# EAGLE schematic blitzbox (EAGLE 7.2.0)
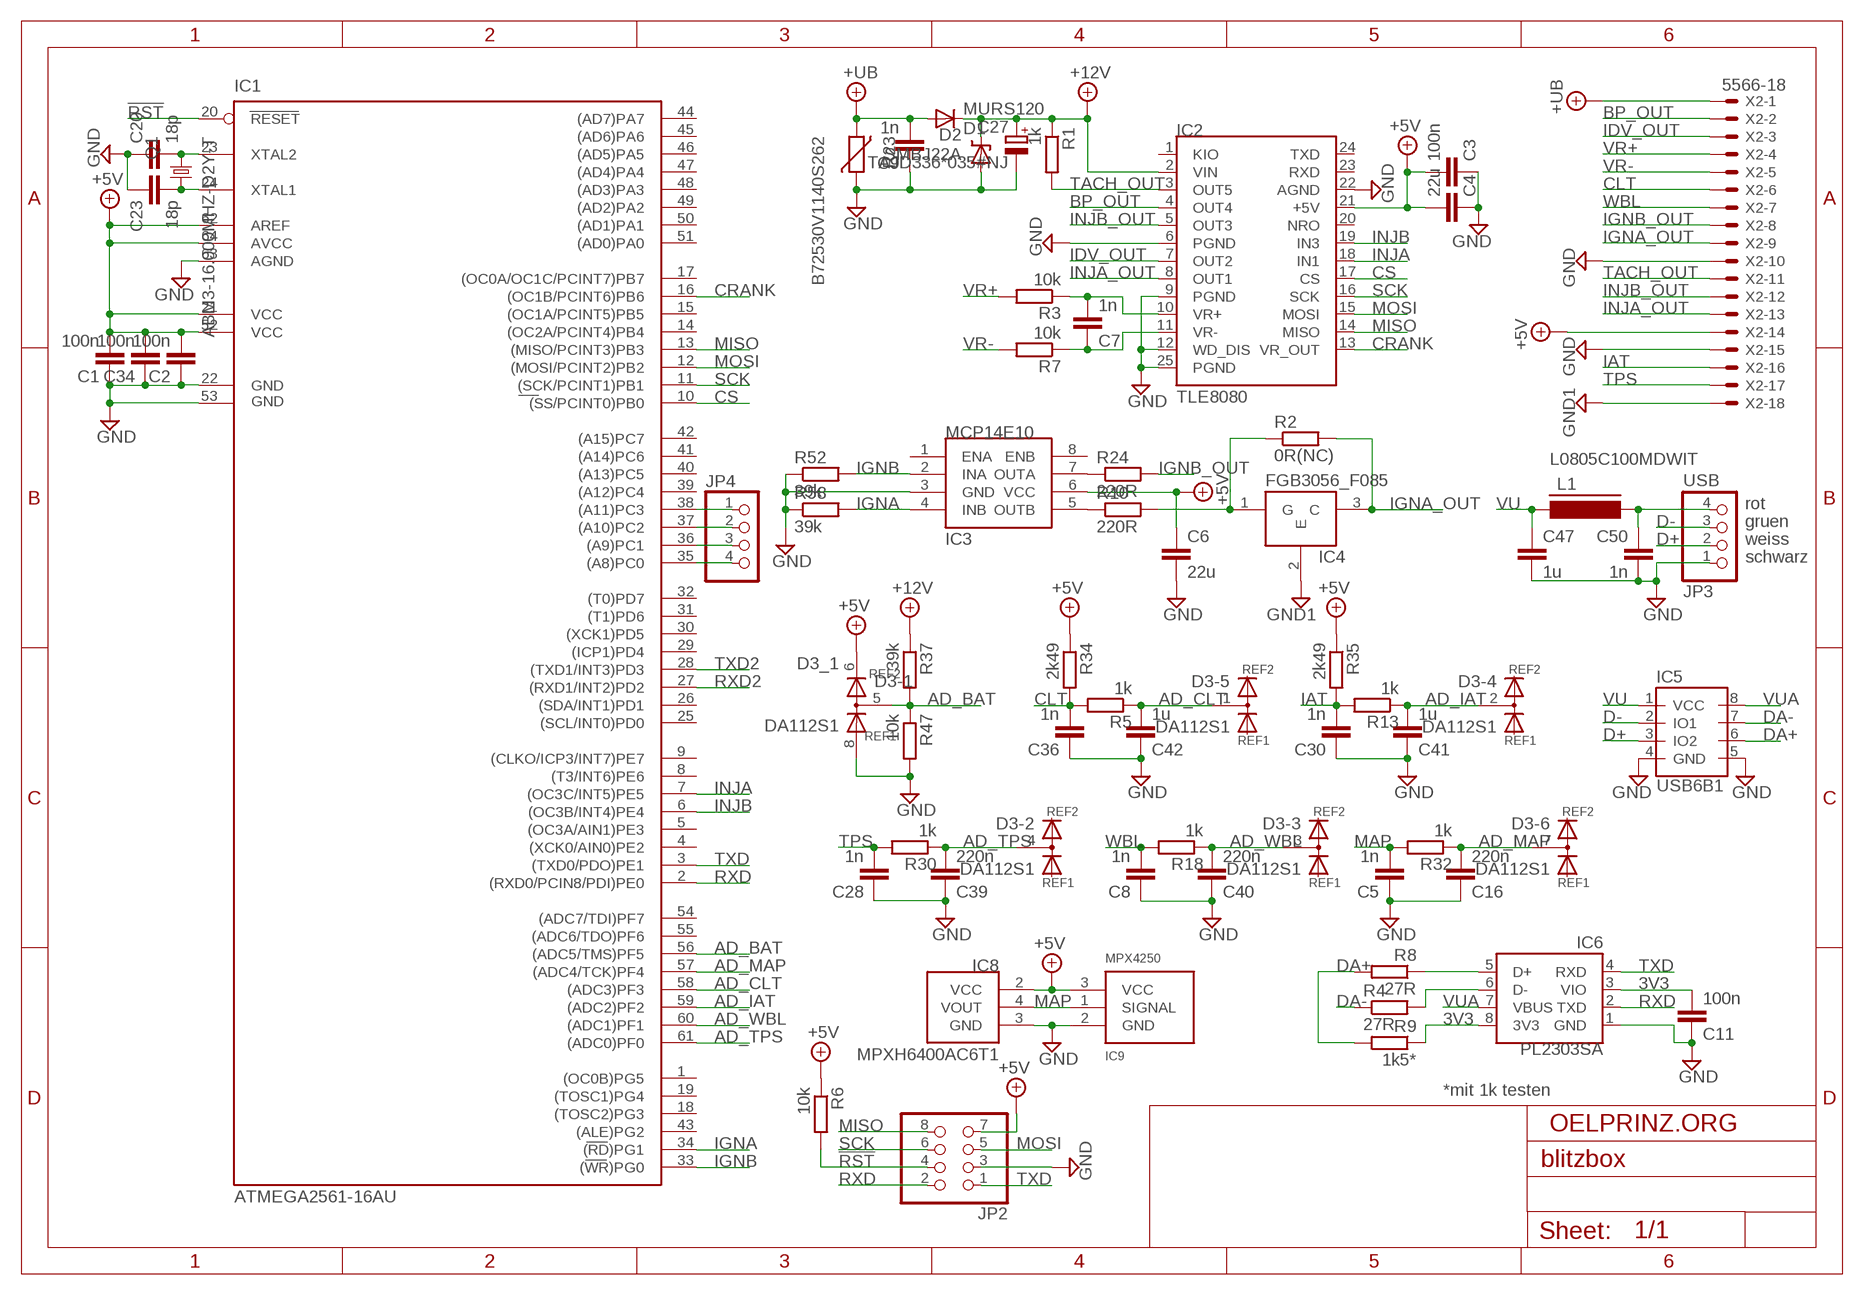
[diagram p0: schematic, sheet 1]

## Parts
C1  100n  C-EUC0805  [C0805]
C2  100n  C-EUC0805  [C0805]
C3  100n  C-EUC0805  [C0805]
C4  22u  C-EUC1210  [C1210]
C5  1n  C-EUC0805  [C0805]
C6  22u  C-EUC1206  [C1206]
C7  1n  C-EUC0805  [C0805]
C8  1n  C-EUC0805  [C0805]
C9  1n  C-EUC0805  [C0805]
C11  100n  C-EUC0805  [C0805]
C16  220n  C-EUC0805  [C0805]
C20  18p  C-EUC0805  [C0805]
C23  18p  C-EUC0805  [C0805]
C27  TAJD336*035#NJ  CPOL-EUSMCD  [SMC_D]
C28  1n  C-EUC0805  [C0805]
C30  1n  C-EUC0805  [C0805]
C34  100n  C-EUC0805  [C0805]
C36  1n  C-EUC0805  [C0805]
C39  220n  C-EUC0805  [C0805]
C40  220n  C-EUC0805  [C0805]
C41  1u  C-EUC0805  [C0805]
C42  1u  C-EUC0805  [C0805]
C47  1u  C-EUC0805  [C0805]
C50  1n  C-EUC0805  [C0805]
D1  MURS120  [MURS120]
D2  SMBJ22A  SUPPRESSOR-SMBJ  [SMBJ]
D3  DA112S1  [SO08]
IC1  ATMEGA2561-16AU  [TQFP64]
IC2  TLE8080  [TLE8080]
IC3  MCP14E10  [SO-08]
IC4  FGB3056_F085  [TO263]
IC5  USB6B1  [SO08]
IC6  PL2303SA  [SO-08]
IC8  MPXH6400AC6T1  MPXH6400  [MPXH6400]
IC9  MPX4250  [MPX4250]
JP2  PINHD-2X4  [2X04]
JP3  USB  PINHD-1X4  [1X04]
JP4  PINHD-1X4  [1X04]
L1  L0805C100MDWIT  FERRITE_BEAD805  [FB805]
Q1  ABM3-16.000MHZ-D2Y-T  ABM3-8.000MHZ-D2Y-T  [ABM3]
R1  1k  R-EU_R0805  [R0805]
R2  0R(NC)  R-EU_R0805  [R0805]
R3  10k  R-EU_R0805  [R0805]
R4  27R  R-EU_R0805  [R0805]
R5  1k  R-EU_R0805  [R0805]
R6  10k  R-EU_R0805  [R0805]
R7  10k  R-EU_R0805  [R0805]
R8  27R  R-EU_R0805  [R0805]
R9  1k5*  R-EU_R0805  [R0805]
R10  220R  R-EU_R0805  [R0805]
R13  1k  R-EU_R0805  [R0805]
R18  1k  R-EU_R0805  [R0805]
R23  B72530V1140S262  VARISTORCN1210  [CT/CN1210]
R24  220R  R-EU_R0805  [R0805]
R30  1k  R-EU_R0805  [R0805]
R32  1k  R-EU_R0805  [R0805]
R34  2k49  R-EU_R0805  [R0805]
R35  2k49  R-EU_R0805  [R0805]
R37  39k  R-EU_R0805  [R0805]
R47  10k  R-EU_R0805  [R0805]
R52  39k  R-EU_R0805  [R0805]
R58  39k  R-EU_R0805  [R0805]
X2  5566-18  [5566-18]

## Nets
3V3: C11.2 IC6.3(VIO) IC6.8(3V3) R9.1
!RST: IC1.20(RESET) JP2.4 R6.2
+5V: C1.2 C2.2 C3.2 C4.2 C6.1 C34.2 D3.6(_1:REF2) IC1.21(VCC) IC1.52(VCC1) IC1.62(AREF) IC1.64(AVCC) IC2.21(+5V) IC3.6(VCC) IC8.2(VCC) IC9.3(VCC) JP2.7 R6.1 R34.1 R35.1 X2.14
+5VU: C50.1 JP3.4 L1.2
+12V: C27.+ D1.2(C) D2.C IC2.2(VIN) R1.1 R37.1
+UB: C9.2 D1.1(A) R23.2 X2.1
AD_BAT: D3.5(-1:K) IC1.56((ADC5/TMS)PF5) R37.2 R47.1
AD_CLT: C42.2 D3.1(-5:K) IC1.58((ADC3)PF3) R5.1
AD_IAT: C41.2 D3.2(-4:K) IC1.59((ADC2)PF2) R13.1
AD_MAP: C16.2 D3.7(-6:K) IC1.57((ADC4/TCK)PF4) R32.1
AD_TPS: C39.2 D3.4(-2:K) IC1.61((ADC0)PF0) R30.1
AD_WBL: C40.2 D3.3(-3:K) IC1.60((ADC1)PF1) R18.1
BP_OUT: IC2.4(OUT4) X2.2
CLT: C36.2 R5.2 R34.2 X2.6
CRANK: IC1.16((OC1B/PCINT6)PB6) IC2.13(VR_OUT)
CS: IC1.10((SS/PCINT0)PB0) IC2.17(CS)
D+: IC5.3(IO2) JP3.2
D-: IC5.2(IO1) JP3.3
DA+: IC5.6(IO2) R8.2 R9.2
DA-: IC5.7(IO1) R4.1
GND: C1.1 C2.1 C3.1 C4.1 C5.1 C6.2 C8.1 C9.1 C11.1 C16.1 C20.1 C23.1 C27.- C28.1 C30.1 C34.1 C36.1 C39.1 C40.1 C41.1 C42.1 C47.2 C50.2 D2.A D3.8(_1:REF1) IC1.22(GND) IC1.53(GND1) IC1.63(AGND) IC2.6(PGND) IC2.9(PGND) IC2.12(WD_DIS) IC2.22(AGND) IC2.25(PGND) IC3.3(GND) IC5.4(GND) IC5.5(GND) IC6.1(GND) IC8.3(GND) IC9.2(GND) JP2.3 JP3.1 R23.1 R47.2 R52.1 R58.1 X2.10 X2.15
GND1: IC4.2(E) X2.18
IAT: C30.2 R13.2 R35.2 X2.16
IDV_OUT: IC2.7(OUT2) X2.3
IGN: IC4.1(G) R2.1 R10.2
IGNA: IC1.34((RD)PG1) IC3.4(INB) R58.2
IGNA_OUT: IC4.3(C) R2.2 X2.9
IGNB: IC1.33((WR)PG0) IC3.2(INA) R52.2
IGNB_OUT: R24.2 X2.8
INJA: IC1.7((OC3C/INT5)PE5) IC2.18(IN1)
INJA_OUT: IC2.8(OUT1) X2.13
INJB: IC1.6((OC3B/INT4)PE4) IC2.19(IN3)
INJB_OUT: IC2.5(OUT3) X2.12
MAP: C5.2 IC8.4(VOUT) IC9.1(SIGNAL) R32.2
MISO: IC1.13((MISO/PCINT3)PB3) IC2.14(MISO) JP2.8
MOSI: IC1.12((MOSI/PCINT2)PB2) IC2.15(MOSI) JP2.5
N$1: C7.1 IC2.11(VR-) R7.1
N$2: IC3.5(OUTB) R10.1
N$5: IC6.6(D-) R4.2
N$6: IC6.5(D+) R8.1
N$7: IC1.38((A11)PC3) JP4.1
N$9: IC1.37((A10)PC2) JP4.2
N$11: IC1.36((A9)PC1) JP4.3
N$12: IC1.35((A8)PC0) JP4.4
N$14: C7.2 IC2.10(VR+) R3.1
N$22: IC3.7(OUTA) R24.1
RXD: IC1.2((RXD0/PCIN8/PDI)PE0) IC6.2(TXD) JP2.2
RXD2: IC1.27((RXD1/INT2)PD2)
SCK: IC1.11((SCK/PCINT1)PB1) IC2.16(SCK) JP2.6
TACH_OUT: IC2.3(OUT5) R1.2 X2.11
TPS: C28.2 R30.2 X2.17
TXD: IC1.3((TXD0/PDO)PE1) IC6.4(RXD) JP2.1
TXD2: IC1.28((TXD1/INT3)PD3)
VR+: R3.2 X2.4
VR-: R7.2 X2.5
VU: C47.1 IC5.1(VCC) L1.1
VUA: IC5.8(VCC) IC6.7(VBUS)
WBL: C8.2 R18.2 X2.7
XTAL1: C20.2 IC1.23(XTAL2) Q1.1
XTAL2: C23.2 IC1.24(XTAL1) Q1.2
Unconnected: IC1.1((OC0B)PG5) IC1.4((XCK0/AIN0)PE2) IC1.5((OC3A/AIN1)PE3) IC1.8((T3/INT6)PE6) IC1.9((CLKO/ICP3/INT7)PE7) IC1.14((OC2A/PCINT4)PB4) IC1.15((OC1A/PCINT5)PB5) IC1.17((OC0A/OC1C/PCINT7)PB7) IC1.18((TOSC2)PG3) IC1.19((TOSC1)PG4) IC1.25((SCL/INT0)PD0) IC1.26((SDA/INT1)PD1) IC1.29((ICP1)PD4) IC1.30((XCK1)PD5) IC1.31((T1)PD6) IC1.32((T0)PD7) IC1.39((A12)PC4) IC1.40((A13)PC5) IC1.41((A14)PC6) IC1.42((A15)PC7) IC1.43((ALE)PG2) IC1.44((AD7)PA7) IC1.45((AD6)PA6) IC1.46((AD5)PA5) IC1.47((AD4)PA4) IC1.48((AD3)PA3) IC1.49((AD2)PA2) IC1.50((AD1)PA1) IC1.51((AD0)PA0) IC1.54((ADC7/TDI)PF7) IC1.55((ADC6/TDO)PF6) IC2.1(KIO) IC2.20(NRO) IC2.23(RXD) IC2.24(TXD) IC3.1(ENA) IC3.8(ENB)

## Notes on the sheet
- rot
- gruen
- weiss
- schwarz
- *mit 1k testen
- OELPRINZ.ORG

## Library data of the parts
C1-C9 C11 C16 C20 C23 C28 C30 C34 C36 C39-C42 C47 C50 = rcl:C-EU: CAPACITOR, European symbol
C27 = rcl:CPOL-EU: POLARIZED CAPACITOR, European symbol
D1 = murs120:MURS120
D2 = diode:SUPPRESSOR-: Suppressor diode
D3 = st-microelectronics:DA112S1: DIODE ARRAY (ASD); MF: Arrow Electronics; MPN: DA112S1; OC_FARNELL: 9802223; OC_NEWARK: 89K0514
IC1 = atmel-2005:ATMEGA2561*: MICROCONTROLLER 256 Kbytes FLASH 4 Kbytes EEPROM 8 Kbytes SRAM 54 General Purpose I/O pins 6-channels 16-bit PWM 2 x Serial USARTs 8-channels 10-bit A/D
IC2 = tle8080:TLE8080
IC3 = mcp14e10:MCP14E10
IC4 = FGB3056_F085:FGB3056_F085
IC5 = st-microelectronics:USB6B1: DATA LINES PROTECTION Source: http://www.st.com/stonline/products/literature/ds/5605.pdf; MPN: USB6B1; OC_FARNELL: 9804358; OC_NEWARK: 26M4750
IC6 = PL2303SA:PL2303SA
IC8 = MPXH6400:MPXH6400
IC9 = mpx4250:MPX4250
JP2 = pinhead:PINHD-2X4: PIN HEADER
JP3 JP4 = pinhead:PINHD-1X4: PIN HEADER
L1 = dp_devices:FERRITE_BEAD
Q1 = ABM3:ABM3-8.000MHZ-D2Y-T
R1-R10 R13 R18 R24 R30 R32 R34 R35 R37 R47 R52 R58 = rcl:R-EU_: RESISTOR, European symbol
R23 = varistor:VARISTOR: VARISTOR
X2 = con-molex:5566-18: Mini FIT connector 18 pol Source: http://www.molex.com; OC_FARNELL: unknown; OC_NEWARK: unknown